# EAGLE design Shruthi-Analog-SMR4-v01 (EAGLE 5.09)
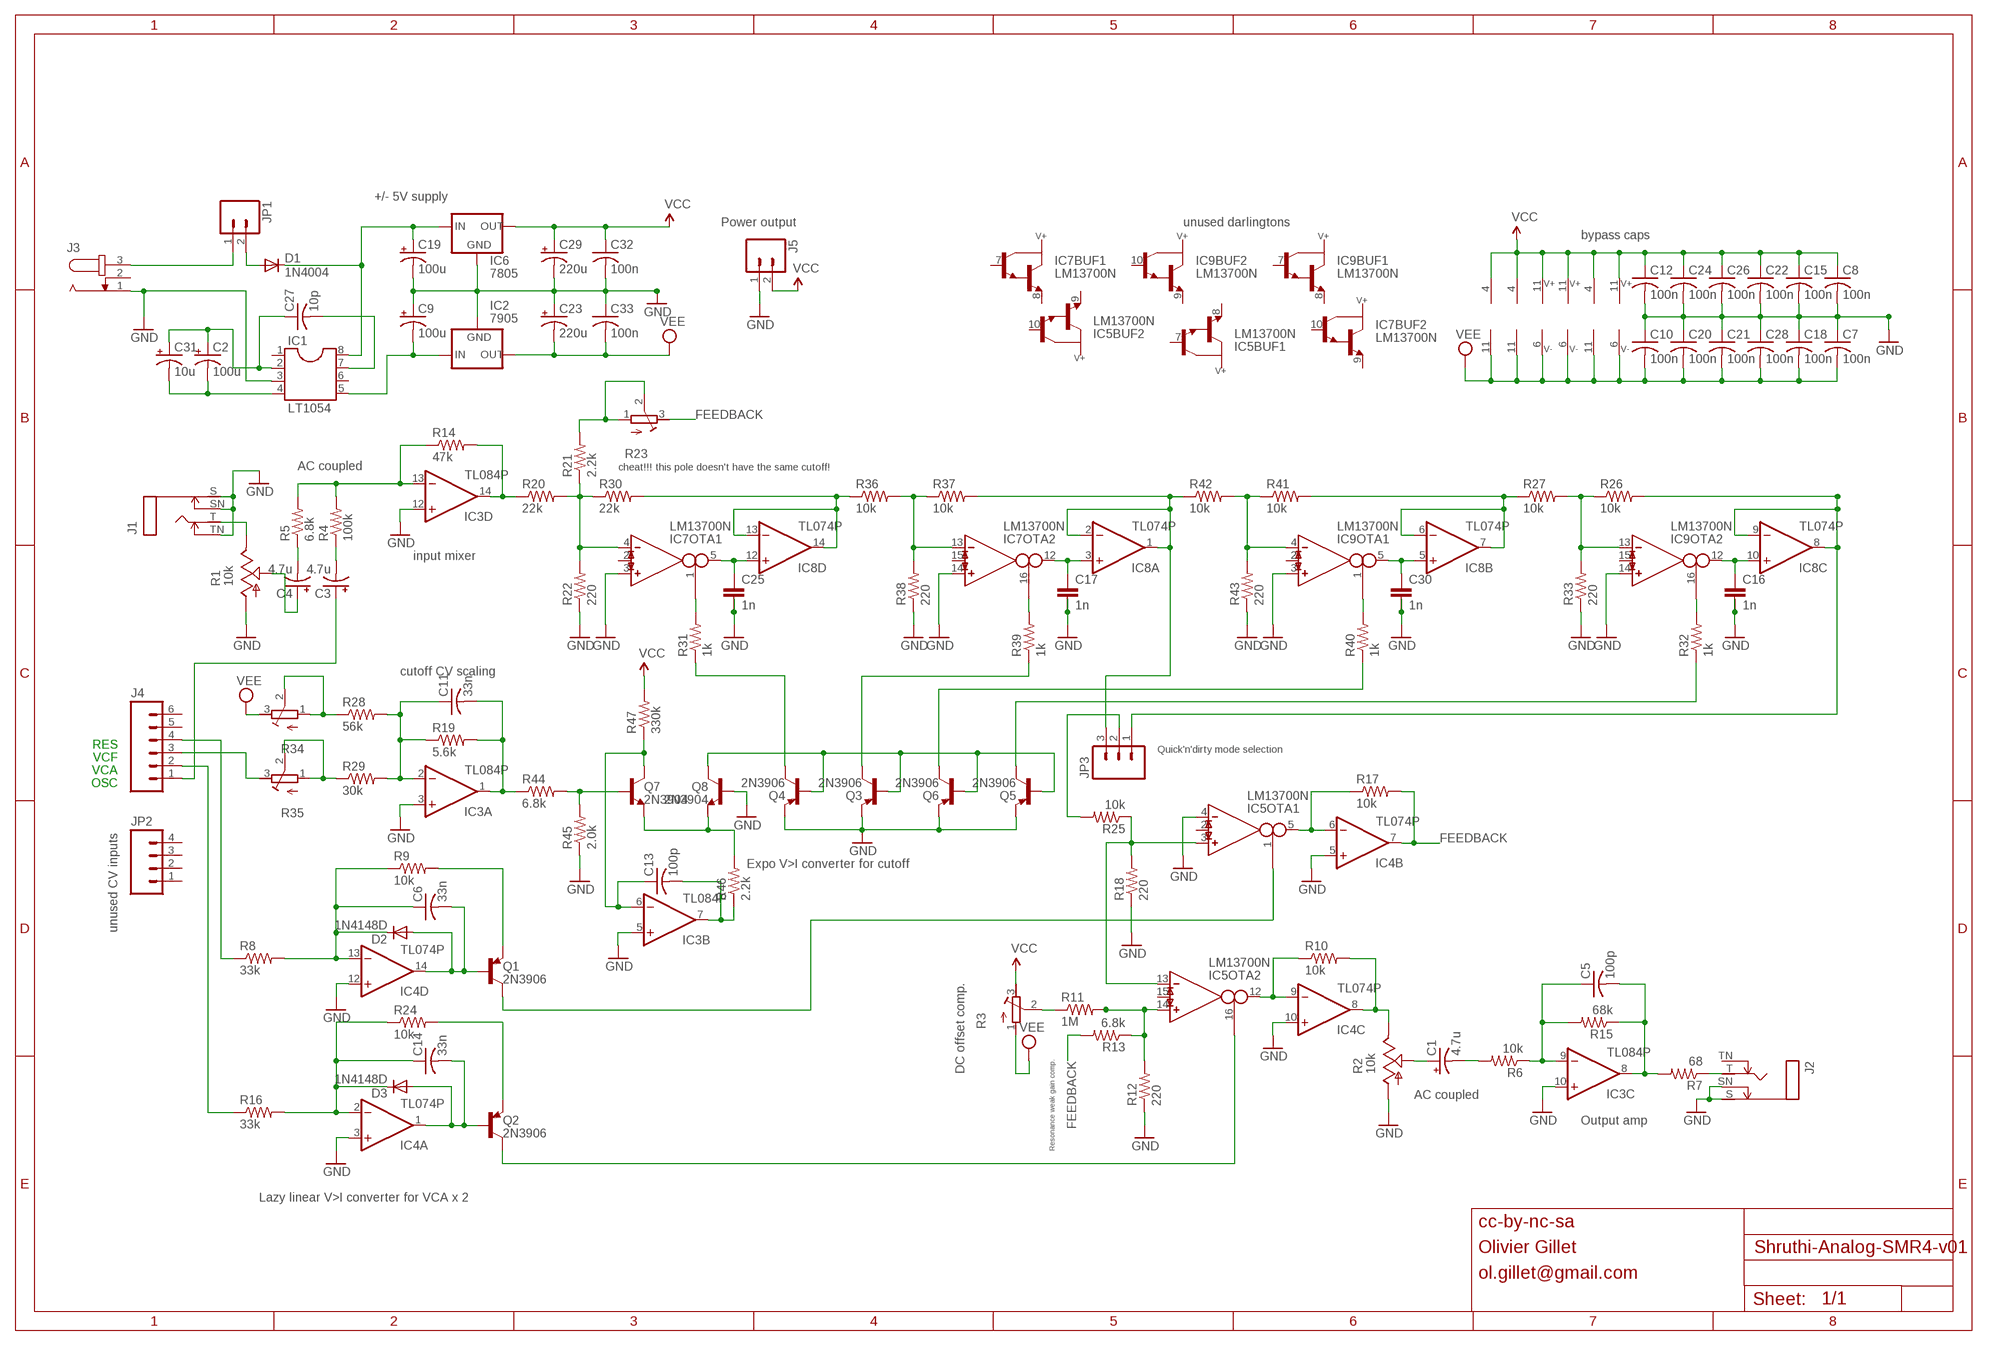
[diagram p0: schematic, sheet 1]

## Parts
C1  4.7u  CPOL-USE2.5-6  [E2,5-6]
C2  100u  CPOL-USE2.5-6  [E2,5-6]
C3  4.7u  CPOL-USE2.5-6  [E2,5-6]
C4  4.7u  CPOL-USE2.5-6  [E2,5-6]
C5  100p  C-US025-025X050  [C025-025X050]
C6  33n  C-US050-025X075  [C050-025X075]
C7  100n  C-US025-025X050  [C025-025X050]
C8  100n  C-US025-025X050  [C025-025X050]
C9  100u  CPOL-USE2.5-7  [E2,5-7]
C10  100n  C-US025-025X050  [C025-025X050]
C11  33n  C-US050-025X075  [C050-025X075]
C12  100n  C-US025-025X050  [C025-025X050]
C13  100p  C-US025-025X050  [C025-025X050]
C14  33n  C-US050-025X075  [C050-025X075]
C15  100n  C-US025-025X050  [C025-025X050]
C16  1n  C-2.5-5/2  [C2.5/5-2]
C17  1n  C-2.5-5/2  [C2.5/5-2]
C18  100n  C-US025-025X050  [C025-025X050]
C19  100u  CPOL-USE2.5-7  [E2,5-7]
C20  100n  C-US025-025X050  [C025-025X050]
C21  100n  C-US025-025X050  [C025-025X050]
C22  100n  C-US025-025X050  [C025-025X050]
C23  220u  CPOL-USE5-10.5  [E5-10,5]
C24  100n  C-US025-025X050  [C025-025X050]
C25  1n  C-2.5-5/2  [C2.5/5-2]
C26  100n  C-US025-025X050  [C025-025X050]
C27  10p  C-US025-025X050  [C025-025X050]
C28  100n  C-US025-025X050  [C025-025X050]
C29  220u  CPOL-USE5-10.5  [E5-10,5]
C30  1n  C-2.5-5/2  [C2.5/5-2]
C31  10u  CPOL-USE2.5-5  [E2,5-5]
C32  100n  C-US025-025X050  [C025-025X050]
C33  100n  C-US025-025X050  [C025-025X050]
D1  1N4004  [DO41-10]
D2  1N4148D  DIODE-D-5  [D-5]
D3  1N4148D  DIODE-D-5  [D-5]
IC1  LT1054  DIL8  [DIL08]
IC2  7905  79XXS  [79XXS]
IC3  TL084P  [DIL14]
IC4  TL074P  TL084P  [DIL14]
IC5  LM13700N  [DIL16]
IC6  7805  78XXS  [78XXS]
IC7  LM13700N  [DIL16]
IC8  TL074P  TL084P  [DIL14]
IC9  LM13700N  [DIL16]
J1  MONOSWS  [NMJ4HC-S]
J2  MONOSWS  [NMJ4HC-S]
J3  JACK-PLUG  [SPC4078_LARGE_HOLES]
J4  M06SIP  [1X06]
J5  M02PTH  [1X02]
JP1  M02  [1X02_LONGPADS]
JP2  M04PTH  [1X04]
JP3  M03LOCK  [1X03_LOCK]
Q1  2N3906  2N3906-  [TO92-]
Q2  2N3906  2N3906-  [TO92-]
Q3  2N3906  2N3906-  [TO92-]
Q4  2N3906  2N3906-  [TO92-]
Q5  2N3906  2N3906-  [TO92-]
Q6  2N3906  2N3906-  [TO92-]
Q7  2N3904  [TO92-]
Q8  2N3904  [TO92-]
R1  10k  POT_USCABLED  [CABLE_POT_6MM]
R2  10k  POT_USCABLED  [CABLE_POT_6MM]
R3  R-TRIMM3296W  [RTRIM3296W]
R4  100k  R-US_0204/7  [0204/7]
R5  6.8k  R-US_0204/7  [0204/7]
R6  10k  R-US_0204/7  [0204/7]
R7  68  R-US_0204/7  [0204/7]
R8  33k  R-US_0204/7  [0204/7]
R9  10k  R-US_0204/7  [0204/7]
R10  10k  R-US_0204/7  [0204/7]
R11  1M  R-US_0204/7  [0204/7]
R12  220  R-US_0204/7  [0204/7]
R13  6.8k  R-US_0204/7  [0204/7]
R14  47k  R-US_0204/7  [0204/7]
R15  68k  R-US_0204/7  [0204/7]
R16  33k  R-US_0204/7  [0204/7]
R17  10k  R-US_0204/7  [0204/7]
R18  220  R-US_0204/7  [0204/7]
R19  5.6k  R-US_0204/7  [0204/7]
R20  22k  R-US_0204/7  [0204/7]
R21  2.2k  R-US_0204/7  [0204/7]
R22  220  R-US_0204/7  [0204/7]
R23  R-TRIMM3296W  [RTRIM3296W]
R24  10k  R-US_0204/7  [0204/7]
R25  10k  R-US_0204/7  [0204/7]
R26  10k  R-US_0204/7  [0204/7]
R27  10k  R-US_0204/7  [0204/7]
R28  56k  R-US_0204/7  [0204/7]
R29  30k  R-US_0204/7  [0204/7]
R30  22k  R-US_0204/7  [0204/7]
R31  1k  R-US_0204/7  [0204/7]
R32  1k  R-US_0204/7  [0204/7]
R33  220  R-US_0204/7  [0204/7]
R34  R-TRIMM3296W  [RTRIM3296W]
R35  R-TRIMM3296W  [RTRIM3296W]
R36  10k  R-US_0204/7  [0204/7]
R37  10k  R-US_0204/7  [0204/7]
R38  220  R-US_0204/7  [0204/7]
R39  1k  R-US_0204/7  [0204/7]
R40  1k  R-US_0204/7  [0204/7]
R41  10k  R-US_0204/7  [0204/7]
R42  10k  R-US_0204/7  [0204/7]
R43  220  R-US_0204/7  [0204/7]
R44  6.8k  R-US_0204/7  [0204/7]
R45  2.0k  R-US_0204/7  [0204/7]
R46  2.2k  R-US_0204/7  [0204/7]
R47  330k  R-US_0204/7  [0204/7]

## Nets
FEEDBACK: IC4.7(B:OUT) R13.2 R17.2 R23.3(A)
GND: C7.1 C8.2 C9.+ C10.1 C12.2 C15.2 C16.2 C16.3 C17.2 C17.3 C18.1 C19.- C20.1 C21.1 C22.2 C23.+ C24.2 C25.2 C25.3 C26.2 C28.1 C29.- C30.2 C30.3 C32.2 C33.1 IC1.3 IC2.GND IC3.3(A:+IN) IC3.5(B:+IN) IC3.10(C:+IN) IC3.12(D:+IN) IC4.3(A:+IN) IC4.5(B:+IN) IC4.10(C:+IN) IC4.12(D:+IN) IC5.4(OTA1:IN_N) IC6.GND IC7.3(OTA1:IN_P) IC7.14(OTA2:IN_P) IC9.3(OTA1:IN_P) IC9.14(OTA2:IN_P) J1.S J1.SN J1.TN J2.S J2.SN J3.1 J5.1 Q3.3(E) Q4.3(E) Q5.3(E) Q6.3(E) Q8.2(B) R1.A R2.A R12.1 R18.1 R22.1 R33.1 R38.1 R43.1 R45.1
N$1: C2.+ C27.1 C31.+ IC1.2
N$2: R21.2 R23.1(E) R23.2(S)
N$3: J3.3 JP1.1
N$4: C19.+ D1.C IC1.8 IC6.IN
N$5: C2.- C31.- IC1.4
N$6: C25.1 IC7.5(OTA1:OUT) IC8.12(D:+IN)
N$7: IC4.6(B:-IN) IC5.5(OTA1:OUT) R17.1
N$8: IC8.13(D:-IN) IC8.14(D:OUT) R30.2 R36.1
N$9: C1.+ R2.S
N$10: IC8.8(C:OUT) IC8.9(C:-IN) JP3.1 R26.2
N$11: C11.2 IC3.1(A:OUT) R19.2 R44.1
N$12: Q7.2(B) R44.2 R45.2
N$13: C13.1 IC3.6(B:-IN) Q7.1(C) R47.1
N$14: C13.2 IC3.7(B:OUT) R46.1
N$16: IC7.4(OTA1:IN_N) R20.2 R21.1 R22.2 R30.1
N$17: Q7.3(E) Q8.3(E) R46.2
N$18: IC7.13(OTA2:IN_N) R36.2 R37.1 R38.2
N$19: IC8.1(A:OUT) IC8.2(A:-IN) JP3.3 R37.2 R42.1
N$20: IC7.1(OTA1:I_BIAS) R31.2
N$21: C30.1 IC8.5(B:+IN) IC9.5(OTA1:OUT)
N$22: IC3.14(D:OUT) R14.2 R20.1
N$23: IC9.4(OTA1:IN_N) R41.1 R42.2 R43.2
N$24: IC7.16(OTA2:I_BIAS) R39.2
N$25: IC8.6(B:-IN) IC8.7(B:OUT) R27.1 R41.2
N$26: IC9.16(OTA2:I_BIAS) R32.2
N$27: IC9.13(OTA2:IN_N) R26.1 R27.2 R33.2
N$28: Q3.2(B) Q4.2(B) Q5.2(B) Q6.2(B) Q8.1(C)
N$29: IC4.9(C:-IN) IC5.12(OTA2:OUT) R10.1
N$30: Q4.1(C) R31.1
N$31: Q3.1(C) R39.1
N$32: Q6.1(C) R40.1
N$33: Q5.1(C) R32.1
N$34: C16.1 IC8.10(C:+IN) IC9.12(OTA2:OUT)
N$35: C3.+ J4.1
N$36: C27.2 IC1.7
N$37: IC3.13(D:-IN) R4.2 R5.2 R14.1
N$38: J1.T R1.E
N$39: C3.- R4.1
N$40: C11.1 IC3.2(A:-IN) R19.1 R28.2 R29.2
N$41: R29.1 R35.1(E) R35.2(S)
N$42: J4.3 R35.3(A)
N$43: R28.1 R34.1(E) R34.2(S)
N$44: C1.- R6.2
N$45: J4.2 R16.1
N$46: JP3.2 R25.2
N$47: J2.T R7.1
N$48: J4.4 R8.1
N$49: C14.1 D3.C IC4.2(A:-IN) R16.2 R24.1
N$50: R3.2(S) R11.1
N$51: IC5.14(OTA2:IN_P) R11.2 R12.2 R13.1
N$55: C6.2 D2.A IC4.14(D:OUT) Q1.2(B)
N$56: C14.2 D3.A IC4.1(A:OUT) Q2.2(B)
N$57: C6.1 D2.C IC4.13(D:-IN) R8.2 R9.1
N$58: C9.- IC1.5 IC2.IN
N$59: D1.A JP1.2
N$60: Q1.3(E) R9.2
N$61: IC5.3(OTA1:IN_P) IC5.13(OTA2:IN_N) R18.2 R25.1
N$63: C5.2 IC3.8(C:OUT) R7.2 R15.1
N$64: C17.1 IC7.12(OTA2:OUT) IC8.3(A:+IN)
N$65: IC5.16(OTA2:I_BIAS) Q2.1(C)
N$66: C4.+ R1.S
N$67: IC5.1(OTA1:I_BIAS) Q1.1(C)
N$68: Q2.3(E) R24.2
N$69: IC9.1(OTA1:I_BIAS) R40.2
N$70: C5.1 IC3.9(C:-IN) R6.1 R15.2
N$71: IC4.8(C:OUT) R2.E R10.2
N$72: C4.- R5.1
VCC: C8.1 C12.1 C15.1 C22.1 C24.1 C26.1 C29.+ C32.1 IC3.4(P:V+) IC4.4(P:V+) IC5.11(SUPPLY:V+) IC6.OUT IC7.11(SUPPLY:V+) IC8.4(P:V+) IC9.11(SUPPLY:V+) J5.2 R3.3(A) R47.2
VEE: C7.2 C10.2 C18.2 C20.2 C21.2 C23.- C28.2 C33.2 IC2.OUT IC3.11(P:V-) IC4.11(P:V-) IC5.6(SUPPLY:V-) IC7.6(SUPPLY:V-) IC8.11(P:V-) IC9.6(SUPPLY:V-) R3.1(E) R34.3(A)
Unconnected: IC1.1 IC1.6 IC5.2(OTA1:I_DIODE) IC5.7(BUF1:B) IC5.8(BUF1:E) IC5.9(BUF2:E) IC5.10(BUF2:B) IC5.15(OTA2:I_DIODE) IC7.2(OTA1:I_DIODE) IC7.7(BUF1:B) IC7.8(BUF1:E) IC7.9(BUF2:E) IC7.10(BUF2:B) IC7.15(OTA2:I_DIODE) IC9.2(OTA1:I_DIODE) IC9.7(BUF1:B) IC9.8(BUF1:E) IC9.9(BUF2:E) IC9.10(BUF2:B) IC9.15(OTA2:I_DIODE) J2.TN J3.2 J4.5 J4.6 JP2.1 JP2.2 JP2.3 JP2.4

## Notes on the sheet
- +/- 5V supply
- Power output | unused darlingtons
- bypass caps
- AC coupled | cheat!!! this pole doesn't have the same cutoff!
- input mixer
- cutoff CV scaling
- RES
- VCF | Quick'n'dirty mode selection
- VCA
- OSC
- Expo V>I converter for cutoff
- unused CV inputs
- DC offset comp.
- AC coupled
- Output amp
- Resonance weak gain comp.
- Lazy linear V>I converter for VCA x 2
- cc-by-nc-sa
- Olivier Gillet
- ol.gillet@gmail.com

## Library data of the parts
C1-C4 C9 C19 C23 C29 C31 = rcl:CPOL-US: POLARIZED CAPACITOR, American symbol
C5-C8 C10-C15 C18 C20-C22 C24 C26-C28 C32 C33 = rcl:C-US: CAPACITOR, American symbol
C16 C17 C25 C30 = capacitor-wima:C-: CAPACITOR for alternative placement naming: default grid - extended grid/package width
D1 = diode:1N4004: DIODE general purpose rectifier, 1 A
D2 D3 = diode:DIODE-: DIODE
IC1 = ic-package:DIL8: Dual In Line / Socket
IC2 = v-reg:79XXS: VOLTAGE REGULATOR
IC3 IC4 IC8 = linear:TL084: OP AMP
IC5 IC7 IC9 = ota:LM13700: Dual OTA with buffers
IC6 = v-reg:78XXS: VOLTAGE REGULATOR
J1 J2 = gm-jacks:MONOSW
J3 = con-jack:JACK-PLUG: DC POWER JACK Power Jack, DC, Right Angle, Through Hole, Rated 5A at 16VDC, PC Terminals Distributor: Farnell (www.Farnell.de) Drawing: 84N1161.pdf / 84N1162.pdf Manufacturer: SPC Technology (www.spctechnology.com) Type: SPC4077 / SPC 4078
J4 = SparkFun:M06: Header 6 Standard 6-pin 0.1" header. Use with straight break away headers (SKU : PRT-00116), right angle break away headers (PRT-00553), swiss pins (PRT-00743), machine pins (PRT-00117), and female headers (PRT-00115). Molex polarized connector foot print use with SKU : PRT-08094 with associated crimp pins and housings. NOTES ON THE VARIANTS LOCK and LOCK_LONGPADS... This footprint was designed to help hold the alignment of a through-hole component (i.e. 6-pin header) while soldering it into place. You may notice that each hole has been shifted either up or down by 0.005 of an inch from it's more standard position (which is a perfectly straight line). This slight alteration caused the pins (the squares in the middle) to touch the edges of the holes. Because they are alternating, it causes a "brace" to hold the component in place. 0.005 has proven to be the perfect amount of "off-center" position when using our standard breakaway headers. Although looks a little odd when you look at the bare footprint, once you have a header in there, the alteration is very hard to notice. Also, if you push a header all the way into place, it is covered up entirely on the bottom side. This idea of altering the position of holes to aid alignment will be further integrated into the Sparkfun Library for other footprints. It can help hold any component with 3 or more connection pins.
J5 JP1 = SparkFun:M02: Header 2 Standard 2-pin 0.1" header. Use with straight break away headers (SKU : PRT-00116), right angle break away headers (PRT-00553), swiss pins (PRT-00743), machine pins (PRT-00117), and female headers (PRT-00115). Molex polarized connector foot print use with SKU : PRT-08233 with associated crimp pins and housings.
JP2 = SparkFun:M04: Header 4 Standard 4-pin 0.1" header. Use with straight break away headers (SKU : PRT-00116), right angle break away headers (PRT-00553), swiss pins (PRT-00743), machine pins (PRT-00117), and female headers (PRT-00115). Molex polarized connector foot print use with SKU : PRT-08231 with associated crimp pins and housings.
JP3 = SparkFun:M03: Header 3 Standard 3-pin 0.1" header. Use with straight break away headers (SKU : PRT-00116), right angle break away headers (PRT-00553), swiss pins (PRT-00743), machine pins (PRT-00117), and female headers (PRT-00115). Molex polarized connector foot print use with SKU : PRT-08232 with associated crimp pins and housings.
Q1-Q6 = gm-trans:2N3906: PNP Transistor
Q7 Q8 = gm-trans:2N3904: NPN Transistor
R1 R2 = pot-cable:POT_US
R3 R23 R34 R35 = rcl:R-TRIMM: Trimm resistor
R4-R22 R24-R33 R36-R47 = rcl:R-US_: RESISTOR, American symbol

## Board
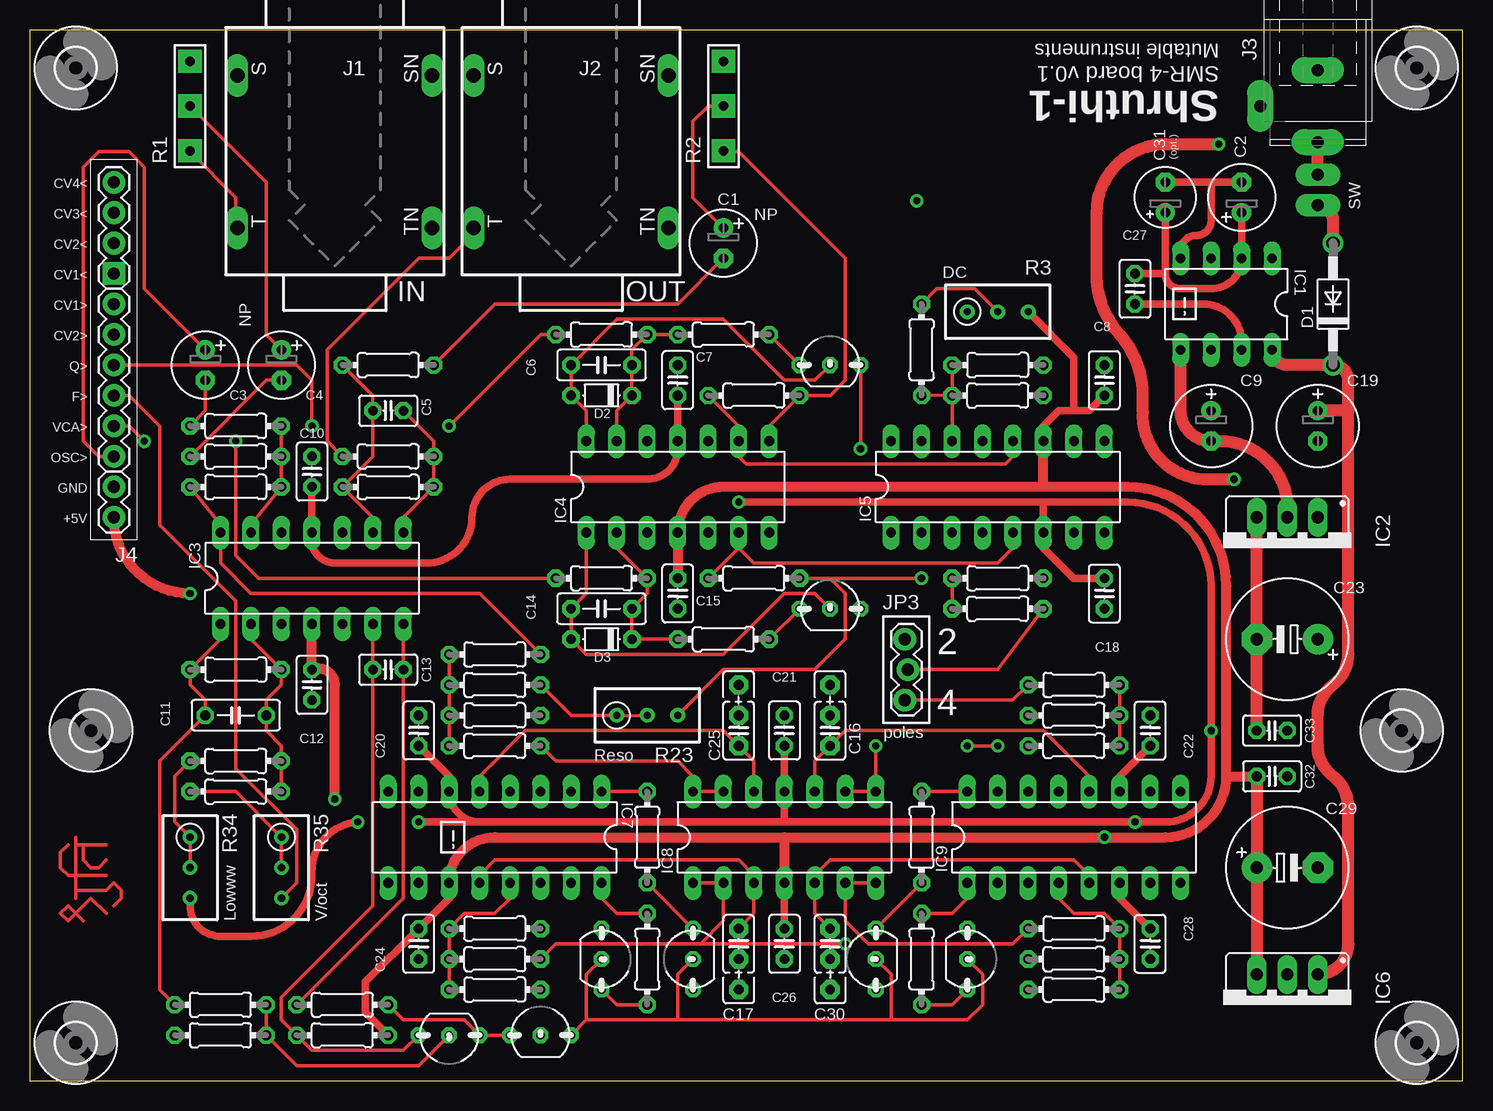
[diagram p1: board, top side]
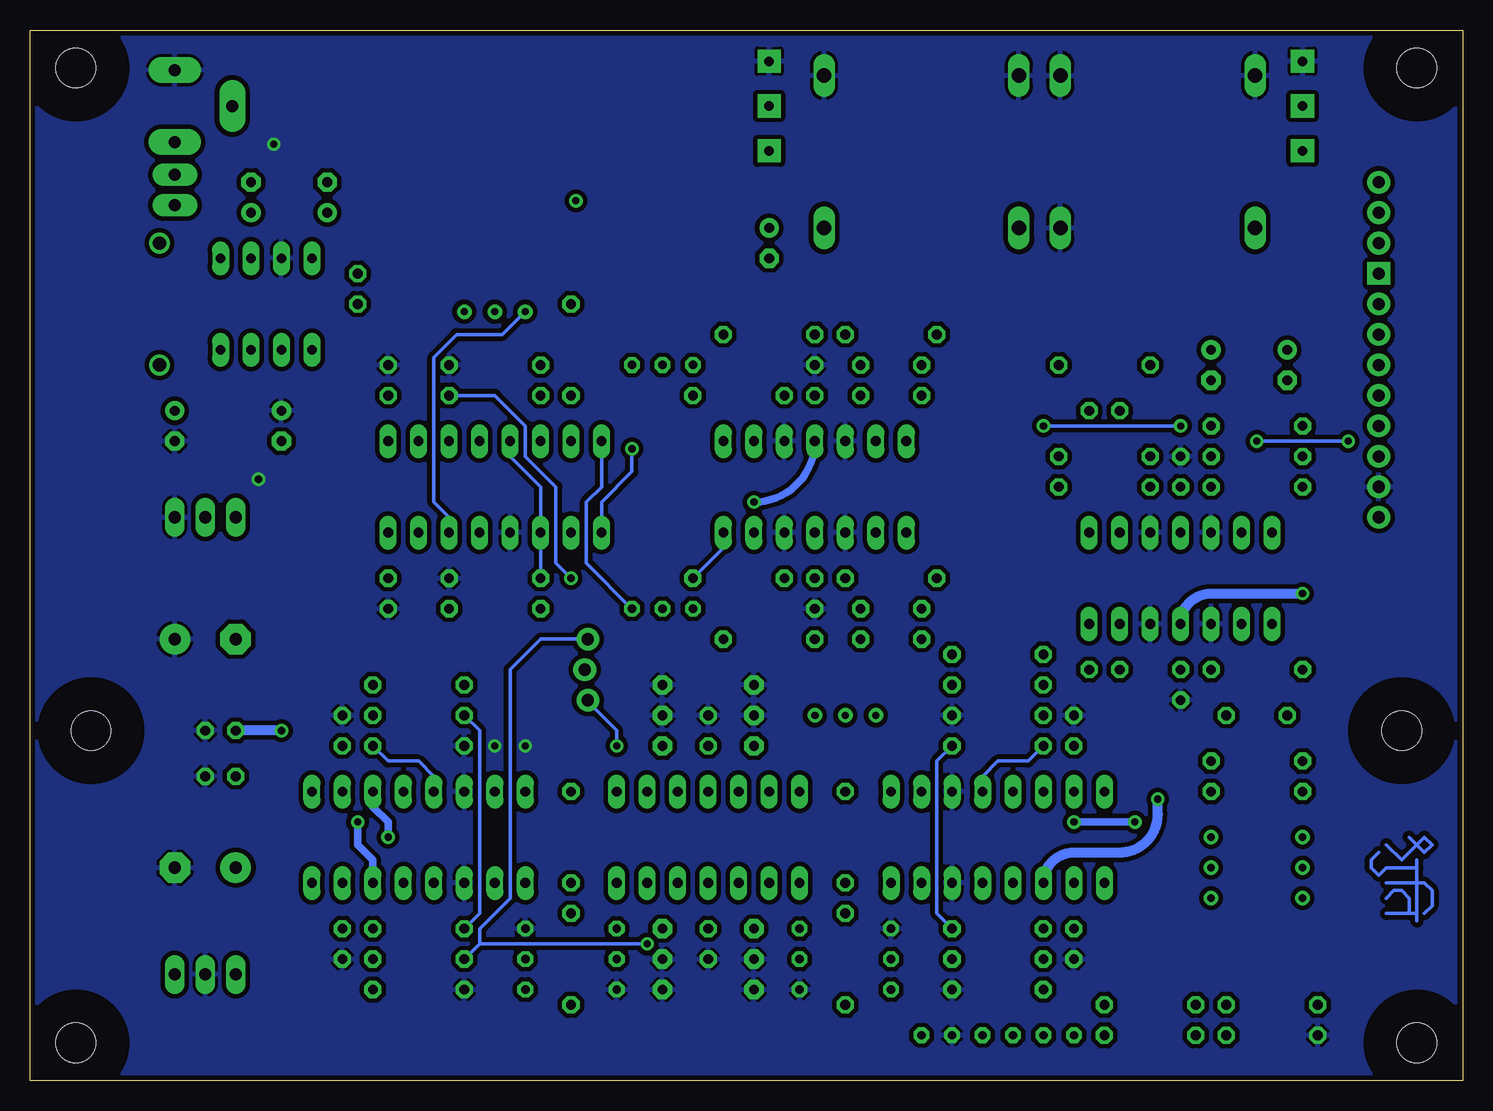
[diagram p2: board, bottom side, seen from below]

Size 119.38 x 87.62 mm. Coordinates in mm from the lower left corner, seen from the top.
Outline: 0,0 119.38,0 119.38,87.62 0,87.62 0,0
Copper layers (1*16): Top 0.035mm / dielectric 1.5mm / Bottom 0.035mm
Design rules "SparkFun_10mil": minimum track width 10mil, minimum drill 20mil, track to track 10mil, track to pad 10mil, pad to pad 10mil, via to via 10mil, smd to smd 10mil, copper to edge 10mil, drill to drill 10mil, minimum pad ring 12mil, minimum via ring 10mil, stop-mask expansion 4mil, vias tented up to drill 25mil, thermal gap 10mil

### Footprints (pad centres in the part's own frame; a part is rotated, then mirrored left to right if it is on the bottom)
E2,5-6 = drill 0.813 pad 1.6 round: + -1.27,0 | drill 0.813 pad 1.6 octagon: - 1.27,0
C025-025X050 = drill 0.813 octagon: 1 -1.27,0; 2 1.27,0
C050-025X075 = drill 0.813 octagon: 1 -2.54,0; 2 2.54,0
E2,5-7 = drill 0.813 pad 1.6 round: + -1.27,0 | drill 0.813 pad 1.6 octagon: - 1.27,0
C2.5/5-2 = drill 0.813 pad 1.6 octagon: 1 -1.27,0; 2 1.27,0; 3 3.81,0
E5-10,5 = drill 1.016 pad 2.54 round: + -2.54,0 | drill 1.016 pad 2.54 octagon: - 2.54,0
E2,5-5 = drill 0.813 pad 1.6 round: + -1.27,0 | drill 0.813 pad 1.6 octagon: - 1.27,0
DO41-10 = drill 1.118 round: A 5.08,0; C -5.08,0
D-5 = drill 0.813 octagon: A 2.54,0; C -2.54,0
DIL08 = drill 0.813 long: 1 -3.81,-3.81; 2 -1.27,-3.81; 3 1.27,-3.81; 4 3.81,-3.81; 5 3.81,3.81; 6 1.27,3.81; 7 -1.27,3.81; 8 -3.81,3.81
79XXS = drill 1.016 long: GND -2.54,-2.54; IN 0,-2.54; OUT 2.54,-2.54
DIL14 = drill 0.813 long: 1 -7.62,-3.81; 2 -5.08,-3.81; 3 -2.54,-3.81; 4 0,-3.81; 5 2.54,-3.81; 6 5.08,-3.81; 7 7.62,-3.81; 8 7.62,3.81; 9 5.08,3.81; 10 2.54,3.81; 11 0,3.81; 12 -2.54,3.81; 13 -5.08,3.81; 14 -7.62,3.81
DIL16 = drill 0.813 long: 1 -8.89,-3.81; 2 -6.35,-3.81; 3 -3.81,-3.81; 4 -1.27,-3.81; 5 1.27,-3.81; 6 3.81,-3.81; 7 6.35,-3.81; 8 8.89,-3.81; 9 8.89,3.81; 10 6.35,3.81; 11 3.81,3.81; 12 1.27,3.81; 13 -1.27,3.81; 14 -3.81,3.81; 15 -6.35,3.81; 16 -8.89,3.81
78XXS = drill 1.016 long: GND 0,-2.54; IN -2.54,-2.54; OUT 2.54,-2.54
NMJ4HC-S = drill 1.2 long: S 5.08,8.115; SN 5.08,-8.115; T -7.62,8.115; TN -7.62,-8.115
SPC4078_LARGE_HOLES = drill 1 pad 2.184 long: 1 -3,0; 2 0,-4.8; 3 3,0
1X06 = drill 1.016 pad 1.88 round: 1 0,0; 2 2.54,0; 3 5.08,0; 4 7.62,0; 5 10.16,0; 6 12.7,0
1X02 = drill 1.016 pad 1.88 round: 1 0,0; 2 2.54,0
1X02_LONGPADS = drill 1.016 pad 1.88 long: 1 0,0; 2 2.54,0
1X04 = drill 1.016 pad 1.88 square: 1 0,0 | drill 1.016 pad 1.88 round: 2 2.54,0; 3 5.08,0; 4 7.62,0
1X03_LOCK = drill 1.016 pad 1.88 round: 1 0,0.127; 2 2.54,-0.127; 3 5.08,0.127
TO92- = drill 0.7 octagon: 1 2.54,0; 2 0,0; 3 -2.54,0
CABLE_POT_6MM = drill 0.8 pad 1.93 square: A -3.73,0; E 3.73,0; S 0,0
RTRIM3296W = drill 0.61 round: 1 0,-2.54; 2 0,0; 3 0,2.54
0204/7 = drill 0.813 octagon: 1 -3.81,0; 2 3.81,0
3,3 = hole 3.3: 0,0

### Placement (x,y rotation side)
C1  57.78,69.85 270 top
C2  100.97,73.66 90 top
C3  14.61,59.69 270 top
C4  20.96,59.69 270 top
C5  29.84,55.88 0 top
C6  47.62,59.69 180 top
C7  53.98,58.42 270 top
C8  89.53,58.42 90 top
C9  98.42,54.61 270 top
C10  23.5,50.8 270 top
C11  17.14,30.48 180 top
C12  23.5,33.02 270 top
C13  29.84,34.29 0 top
C14  47.62,39.37 180 top
C15  53.98,40.64 270 top
C16  66.67,29.21 90 top
C17  59.05,11.43 270 top
C18  89.53,40.64 90 top
C19  107.31,54.61 270 top
C20  32.38,29.21 270 top
C21  62.87,29.21 270 top
C22  93.34,29.21 90 top
C23  104.78,36.83 180 top
C24  32.38,11.43 270 top
C25  59.05,29.21 90 top
C26  62.87,11.43 270 top
C27  92.08,66.04 270 top
C28  93.34,11.43 90 top
C29  104.78,17.78 0 top
C30  66.67,11.43 270 top
C31  94.61,73.66 90 top
C32  103.5,25.4 0 top
C33  103.5,29.21 180 top
D1  108.58,64.77 90 top
D2  47.62,57.15 180 top
D3  47.62,36.83 180 top
IC1  99.69,64.77 180 top
IC2  104.78,44.45 180 top
IC3  23.5,41.91 0 top
IC4  53.98,49.53 0 top
IC5  80.64,49.53 0 top
IC6  104.78,6.35 180 top
IC7  38.73,20.32 180 top
IC8  62.87,20.32 0 top
IC9  87,20.32 0 top
J1  25.4,78.74 90 top
J2  45.09,78.74 90 top
J3  107.31,81.28 270 top
J4  6.99,52.07 90 top
J5  6.99,49.53 270 top
JP1  107.31,75.56 270 top
JP2  6.99,67.31 90 top
JP3  73.03,31.75 90 top
Q1  66.67,59.69 0 top
Q2  66.67,39.37 0 top
Q3  47.62,10.16 270 top
Q4  55.24,10.16 90 top
Q5  70.48,10.16 90 top
Q6  78.11,10.16 270 top
Q7  34.93,3.81 180 top
Q8  42.55,3.81 0 top
R1  13.34,81.28 270 top
R2  57.78,81.28 270 top
R3  5k  [RTRIM3296W]  80.64,64.14 270 top
R4  17.14,54.61 0 top
R5  17.14,52.07 0 top
R6  29.84,59.69 0 top
R7  29.84,52.07 0 top
R8  47.62,62.23 0 top
R9  57.78,62.23 0 top
R10  60.33,57.15 0 top
R11  74.3,60.96 270 top
R12  80.64,59.69 180 top
R13  80.64,57.15 0 top
R14  17.14,49.53 180 top
R15  29.84,49.53 180 top
R16  47.62,41.91 0 top
R17  60.33,41.91 0 top
R18  80.64,41.91 180 top
R19  17.14,34.29 180 top
R20  38.73,35.56 180 top
R21  38.73,33.02 0 top
R22  38.73,30.48 180 top
R23  5k  [RTRIM3296W]  51.44,30.48 270 top
R24  57.78,36.83 0 top
R25  80.64,39.37 0 top
R26  87,33.02 180 top
R27  87,30.48 0 top
R28  17.14,26.67 0 top
R29  17.14,24.13 0 top
R30  38.73,27.94 0 top
R31  51.44,20.32 90 top
R32  74.3,20.32 90 top
R33  87,27.94 0 top
R34  20k  [RTRIM3296W]  13.34,17.78 180 top
R35  5k  [RTRIM3296W]  20.96,17.78 180 top
R36  38.73,12.7 180 top
R37  38.73,10.16 0 top
R38  38.73,7.62 180 top
R39  51.44,10.16 90 top
R40  74.3,10.16 90 top
R41  87,12.7 180 top
R42  87,10.16 0 top
R43  87,7.62 0 top
R44  15.88,6.35 0 top
R45  15.88,3.81 0 top
R46  26.04,6.35 0 top
R47  26.04,3.81 0 top
U$1  [3,3]  3.81,84.45 0 top
U$2  [3,3]  115.57,84.45 0 top
U$3  [3,3]  5.08,29.21 0 top
U$4  [3,3]  114.3,29.21 0 top
U$5  [3,3]  3.81,3.17 0 top
U$6  [3,3]  115.57,3.17 0 top

### Tracks (layer width: path | path; a pad name or v marks a point on that pad's centre or on a via)
FEEDBACK  (via drill 0.6)
  Top 0.305: 66.67,41.91 67.95,40.64 67.95,36.83 65.41,34.29 57.78,34.29 R23.3 | 66.67,41.91 R17.2 | 66.67,41.91 v74.3,41.91
  Bottom 0.305: IC4.7 61.59,44.45 R17.2 | v74.3,41.91 75.56,43.18 75.56,49.53 78.11,52.07 78.11,54.61 80.64,57.15 R13.2
GND  (via drill 0.6)
  Top 0.305: v78.11,27.94 v80.64,27.94
  Top 1.016: v99.06,78.11 94.65,78.11 arc90 88.9,72.36 88.9,66.67 arc37 90.8,62.23 arc-37 92.71,57.79 92.71,55.88 arc90 97.79,50.16 v100.33,50.16
  pour Bottom (isolate 0.381): 0.64,87 0.64,0.64 118.75,0.64 118.75,87
N$1
  Top 0.61: C2.+ IC1.2 arc-90 98.42,66.04 95.89,66.04 arc-90 94.61,67.31 | 94.61,67.31 C31.+ | C27.1 94.61,67.31
N$2
  Top 0.254: R23.1 R23.2
  Top 0.305: R23.1 45.09,30.48 R21.2
N$3
  Top 1.016: JP1.1 J3.3
N$4
  Top 1.016: IC6.IN arc90 109.86,11.43 109.86,22.86 arc53 108.58,25.4 arc-53 107.31,27.94 107.31,30.48 arc-53 108.58,33.02 arc53 109.86,35.56 109.86,55.88 | 109.86,55.88 109.86,58.42 arc90 D1.C 104.78,59.69 arc-90 IC1.8 | 109.86,55.88 C19.+
N$5
  Top 0.61: 98.42,74.93 C31.- | 98.42,74.93 C2.- | IC1.4 95.89,69.22 arc-90 97.16,70.48 arc90 98.42,71.75 98.42,74.93
N$6
  Top 0.305: IC7.5 37.47,25.4 41.27,29.21 57.78,29.21 C25.1 60.33,26.67 IC8.12
N$7
  Top 0.305: R17.1 59.05,44.45 | 59.05,44.45 IC4.6 | 59.05,44.45 60.33,43.18 80.64,43.18 81.92,44.45 IC5.5
N$8
  Top 0.305: IC8.13 IC8.14 55.24,25.4 53.98,26.67 43.81,26.67 R30.2
  Bottom 0.305: R36.1 43.81,13.97 43.81,26.67 R30.2
N$9
  Top 0.305: R2.S 56.52,81.28 55.24,80.01 55.24,73.66 C1.+
N$10  (via drill 0.6)
  Top 0.305: R26.2 81.92,31.75 JP3.1 | IC8.9 IC8.8 v70.48,27.94
  Bottom 0.305: JP3.1 73.03,31.75 70.48,29.21 v70.48,27.94
N$11
  Top 0.305: IC3.1 15.88,36.83 R19.2 13.34,33.02 14.61,31.75 C11.2 10.79,26.67 10.79,7.62 R44.1
N$12
  Top 0.305: Q7.2 32.38,1.27 22.23,1.27 R45.2 R44.2
N$13
  Top 0.305: IC3.6 C13.1 28.57,14.61 20.96,6.98 20.96,5.08 R47.1 23.5,2.54 31.11,2.54 Q7.1
N$14
  Top 0.305: IC3.7 C13.2 31.11,15.24 R46.1
N$15
  Bottom 0.305: 6.35,19.68 5.08,18.41 3.18,20.32 2.54,19.68 3.18,19.05 4.45,20.32
N$16
  Top 0.305: R20.2 R21.1 R22.2 R30.1
  Bottom 0.305: IC7.4 40.01,25.4 38.73,26.67 36.2,26.67 R30.1
N$17
  Top 0.305: Q8.3 Q7.3 36.2,5.08 31.11,5.08 R46.2
N$18
  Top 0.305: R38.2 R37.1 R36.2 36.2,13.97 38.73,13.97 40.01,15.24 IC7.13
N$19  (via drill 0.6)
  Top 0.305: IC8.1 IC8.2 57.78,13.34 55.88,11.43 | 55.88,11.43 43.81,11.43 R37.2 | 55.88,11.43 v67.95,11.43
  Bottom 0.305: 81.92,11.43 R42.1 | v67.95,11.43 81.92,11.43 | JP3.3 76.83,36.83 79.38,34.29 79.38,15.24 81.92,12.7 81.92,11.43
N$20
  Top 0.305: IC7.1 R31.2
N$21
  Top 0.305: IC9.5 88.27,17.14 87,18.41 66.67,18.41 65.41,17.14 IC8.5 65.41,13.97 C30.1
N$22
  Top 0.305: R14.2 15.88,46.36 IC3.14 15.88,43.18 18.41,40.64 37.47,40.64 R20.1
N$23
  Top 0.305: R43.2 R42.2 R41.1 89.53,13.97 87,13.97 85.72,15.24 IC9.4
N$24
  Top 0.305: IC7.16 47.62,15.24 48.89,13.97 R39.2
N$25
  Top 0.305: IC8.7 IC8.6 67.95,13.34 69.85,11.43 81.92,11.43 R41.2
  Bottom 0.305: R41.2 81.92,13.97 81.92,29.21 R27.1
N$26
  Top 0.305: R32.2 IC9.16
N$27
  Top 0.305: R26.1 R27.2 R33.2
  Bottom 0.305: R33.2 89.53,26.67 87,26.67 85.72,25.4 IC9.13
N$28
  Top 0.305: Q8.1 46.35,5.08 | 46.35,5.08 53.98,5.08 | 53.98,5.08 71.75,5.08 | 71.75,5.08 78.11,5.08 79.38,6.35 79.38,8.89 Q6.2 | Q5.2 71.75,8.89 71.75,5.08 | Q4.2 53.98,8.89 53.98,5.08 | Q3.2 46.35,8.89 46.35,5.08
N$29
  Top 0.305: IC5.12 81.92,52.07 81.28,51.44 59.69,51.44 59.05,52.07 IC4.9 59.05,54.61 R10.1
N$30
  Top 0.305: Q4.1 R31.1
N$31
  Top 0.305: Q3.1 48.89,6.35 R39.1
N$32
  Top 0.305: R40.1 76.83,6.35 Q6.1
N$33
  Top 0.305: Q5.1 R32.1
N$34
  Top 0.305: IC8.10 65.41,26.67 C16.1 67.95,29.21 84.45,29.21 88.27,25.4 IC9.12
N$35
  Top 0.305: J4.1 5.71,52.07 4.45,53.34 4.45,76.2 5.71,77.47 8.26,77.47 9.53,76.2 9.53,66.04 C3.+
N$36
  Top 0.61: IC1.7 100.97,61.59 arc90 97.79,64.77 C27.2
N$37
  Top 0.305: IC3.13 18.41,46.36 R14.1 R5.2 R4.2
N$38
  Top 0.305: J1.T 17.14,71.26 17.14,73.66 13.34,77.47 R1.E
N$39
  Top 0.305: R4.1 14.61,55.88 C3.-
N$40
  Top 0.305: R29.2 R28.2 20.96,27.94 19.68,29.21 C11.1 19.68,31.75 20.96,33.02 R19.1 18.41,36.83 IC3.2
N$41
  Top 0.305: R35.2 R35.1 17.14,24.13 R29.1
N$42
  Top 0.305: J4.3 8.26,57.15 10.79,54.61 10.79,46.36 17.14,40.01 17.14,26.04 22.23,20.95 22.23,16.51 R35.3
N$43
  Top 0.305: R28.1 12.07,25.4 12.07,21.59 R34.1 R34.2
N$44
  Top 0.305: R6.2 38.73,64.77 53.98,64.77 C1.-
N$45  (via drill 0.6)
  Top 0.305: v17.14,53.34 17.14,43.82 19.05,41.91 R16.1 | J4.2 8.26,54.61 v9.53,53.34
  Bottom 0.305: v17.14,53.34 v9.53,53.34
N$46
  Top 0.305: JP3.2 80.64,34.29 R25.2
N$47
  Top 0.305: R7.1 24.77,53.34 24.77,60.96 32.38,68.58 34.93,68.58 36.97,70.62 J2.T
N$48  (via drill 0.6)
  Top 0.305: J4.4 22.23,59.69 23.5,58.42 v23.5,54.61 | v34.93,54.61 42.55,62.23 R8.1
  Bottom 0.305: v23.5,54.61 v34.93,54.61
N$49
  Top 0.305: IC4.2 48.89,44.45 R16.2 51.44,40.64 C14.1 D3.C R24.1
N$50
  Top 0.305: R11.1 75.56,66.04 78.74,66.04 R3.2
N$51
  Top 0.254: R13.1 R11.2
  Top 0.305: R12.2 R13.1 IC5.14
N$52
  Bottom 0.305: 3.81,17.78 3.81,18.41 | 3.81,16.51 3.81,17.78 | 3.81,13.97 3.81,16.51 | 3.81,13.34 3.81,13.97 | 4.45,13.97 6.35,13.97 | 3.81,13.97 4.45,13.97 | 4.45,13.97 4.45,15.24 5.08,15.88 5.71,15.88 6.35,15.24 | 3.81,17.78 6.35,17.78 6.99,17.14 7.62,17.78 7.62,18.41 6.99,19.05 | 3.81,16.51 6.35,16.51 | 3.81,16.51 3.18,16.51 2.54,15.88 2.54,14.61 3.18,13.97
N$53
  Top 0.305: 6.35,13.97 5.08,15.24 3.18,13.34 2.54,13.97 3.18,14.61 4.45,13.34
N$54
  Top 0.305: 3.81,15.88 3.81,15.24 | 3.81,15.88 3.81,17.14 | 3.81,17.14 3.81,19.68 | 3.81,19.68 3.81,20.32 | 4.45,19.68 6.35,19.68 | 3.81,19.68 4.45,19.68 | 4.45,19.68 4.45,18.41 5.08,17.78 5.71,17.78 6.35,18.41 | 3.81,15.88 6.35,15.88 6.99,16.51 7.62,15.88 7.62,15.24 6.99,14.61 | 3.81,17.14 6.35,17.14 | 3.81,17.14 3.18,17.14 2.54,17.78 2.54,19.05 3.18,19.68
N$55
  Top 0.305: Q1.2 65.41,58.42 62.87,58.42 57.78,63.5 48.89,63.5 C6.2 D2.A 46.35,55.88 IC4.14
N$56
  Top 0.305: IC4.1 46.35,40.64 C14.2 D3.A 46.35,35.56 57.78,35.56 62.87,40.64 65.41,40.64 Q2.2
N$57
  Top 0.305: R9.1 R8.2 50.16,60.96 C6.1 D2.C 48.89,55.88 IC4.13
N$58
  Top 1.016: IC1.5 95.89,55.88 arc90 C9.- 99.69,53.34 arc-90 IC2.IN
N$59
  Top 1.016: D1.A 108.58,71.75 arc90 JP1.2
N$60
  Top 0.305: Q1.3 R9.2
N$61
  Top 0.305: R25.1 R18.2
  Bottom 0.305: IC5.13 79.38,52.07 76.83,49.53 IC5.3 R18.2
N$62  (via drill 0.6)
  other vias: 73.89,73.38
N$63
  Top 0.305: IC3.8 31.11,46.99 R15.1 R7.2 33.66,53.34 C5.2
N$64
  Top 0.305: IC7.12 37.47,17.14 38.73,18.41 59.05,18.41 60.33,17.14 IC8.3 60.33,13.97 C17.1
N$65
  Bottom 0.305: Q2.1 73.03,43.18 73.03,48.26 71.75,49.53 IC5.16
N$66
  Top 0.305: C4.+ 19.68,62.23 19.68,74.93 R1.S
N$67  (via drill 0.6)
  Top 0.305: v69.22,52.71 Q1.1
  Bottom 0.305: v69.22,52.71 69.22,50.8 71.75,48.26 IC5.1
N$68
  Top 0.305: R24.2 Q2.3
N$69
  Top 0.305: R40.2 76.83,13.97 78.11,15.24 IC9.1
N$70
  Top 0.305: IC3.9 28.57,46.99 R15.2 28.57,52.07 C5.1 28.57,57.15 R6.1
N$71
  Top 0.305: R2.E 57.87,77.47 59.05,77.47 67.95,68.58 67.95,58.42 66.67,57.15 R10.2 61.59,54.61 IC4.8
N$72
  Top 0.305: R5.1 19.68,58.42 C4.-
VCC  (via drill 0.6)
  Top 0.61: C8.1 88.27,55.88 87,55.88 | 87,55.88 85.72,55.88 84.45,54.61 IC5.11 | IC8.4 C26.1 | 87,55.88 87,60.33 R3.3 | IC7.11 34.93,15.24 C24.1 27.94,8.26 27.94,5.71 R47.2 | IC6.OUT C29.+ | C22.1 90.8,25.4 IC9.11
  Top 0.813: 84.45,49.53 IC5.11 | C15.1 IC4.4 arc-90 57.78,49.53 84.45,49.53 | 84.45,49.53 91.44,49.53 arc-90 99.69,41.28 99.69,25.4 | 99.69,25.4 arc-90 94.61,20.32 v89.53,20.32 62.87,20.32 | 62.87,20.32 38.73,20.32 arc90 IC7.11 | 62.87,20.32 IC8.4 | v13.34,40.64 arc-90 J5.2 | v25.4,23.49 25.4,33.02 arc113 C12.1 IC3.4 | 99.69,25.4 C32.1
  Top 1.016: C32.1 IC6.OUT
  Bottom 0.61: IC9.11 90.8,22.86 89.53,21.59 v89.53,20.32
  Bottom 0.813: v25.4,23.49 25.4,22.22 arc90 28.57,19.05 32.38,19.05 arc-90 IC7.11 | IC3.4 arc90 20.96,40.64 v13.34,40.64
VEE  (via drill 0.6)
  Top 0.61: C10.2 IC3.11 23.5,45.09 arc90 25.4,43.18 33.02,43.18 arc90 36.83,46.99 arc-90 40.01,50.16 51.44,50.16 arc90 53.98,52.71 IC4.11 C7.2 | IC9.6 90.8,15.24 C28.2 | IC8.11 C21.2 62.87,21.59 | C20.2 34.93,25.4 IC7.6 arc90 37.47,21.59 | 84.45,48.26 91.44,48.26 arc-90 98.42,41.28 v98.42,29.21 98.42,25.4 arc-90 94.61,21.59 v92.08,21.59 62.87,21.59 | 84.45,48.26 v59.05,48.26 | R34.3 13.34,14.61 arc90 15.88,12.07 18.41,12.07 arc90 23.5,17.14 arc-90 v27.3,21.59 | v32.38,21.59 37.47,21.59 | 37.47,21.59 62.87,21.59 | C18.2 87,41.91 84.45,44.45 IC5.6 84.45,48.26
  Top 1.016: C33.2 C23.- IC2.OUT
  Bottom 0.305: R3.1 80.01,62.23 83.82,62.23 85.72,60.33 85.72,48.26 84.45,46.99 IC5.6
  Bottom 0.61: v59.05,48.26 arc-90 IC4.11 | v27.3,21.59 v32.38,21.59 | IC9.6 90.8,18.41 92.08,19.68 v92.08,21.59
  Bottom 0.813: v98.42,29.21 C33.2

### Text on the board
tPlace: Mutable instruments | CV4< | CV3< | CV2< | CV1< | CV1> | CV2> | Q> | F> | VCA> | OSC> | GND | +5V
tNames: SMR-4 board v0.1 | Shruthi-1 | (opt.) | SW | NP | DC | IN | OUT | NP | 2 | 4 | poles | Reso | Lowww | V/oct
tValues: x2 | x2 | x2